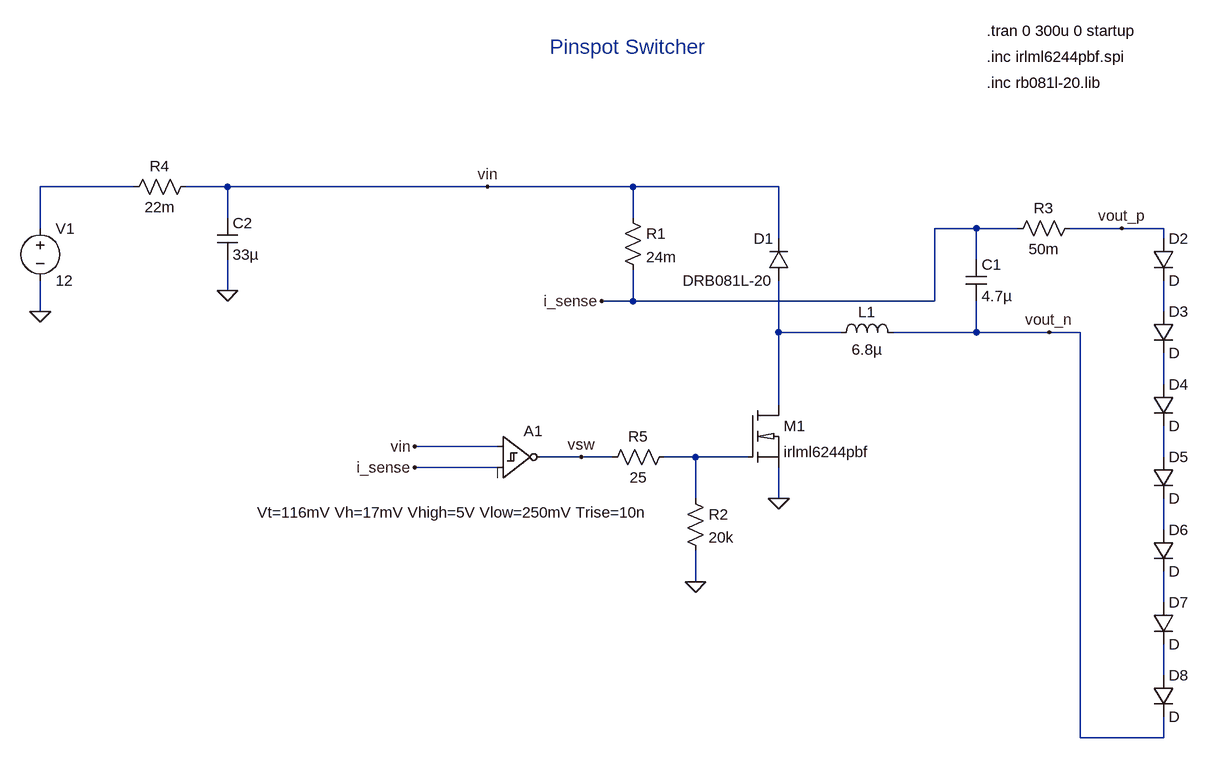
[diagram p0: schematic switcher.asc]
switcher.asc, the LTspice schematic file:
Version 4
SHEET 1 880 1188
WIRE -992 336 -1136 336
WIRE -848 336 -912 336
WIRE -448 336 -848 336
WIRE -224 336 -448 336
WIRE 0 336 -224 336
WIRE -848 384 -848 336
WIRE -224 384 -224 336
WIRE -1136 400 -1136 336
WIRE 304 400 240 400
WIRE 368 400 304 400
WIRE 528 400 448 400
WIRE 592 400 528 400
WIRE 0 416 0 336
WIRE 592 416 592 400
WIRE 304 448 304 400
WIRE -848 496 -848 448
WIRE -224 512 -224 464
WIRE -224 512 -272 512
WIRE 240 512 240 400
WIRE 240 512 -224 512
WIRE -1136 528 -1136 480
WIRE 592 528 592 480
WIRE 0 560 0 480
WIRE 96 560 0 560
WIRE 304 560 304 512
WIRE 304 560 176 560
WIRE 416 560 304 560
WIRE 464 560 416 560
WIRE 592 640 592 592
WIRE 0 672 0 560
WIRE -432 736 -560 736
WIRE -304 752 -368 752
WIRE -256 752 -304 752
WIRE -128 752 -176 752
WIRE -48 752 -128 752
WIRE 592 752 592 704
WIRE -432 768 -560 768
WIRE -128 816 -128 752
WIRE 0 816 0 768
WIRE 592 864 592 816
WIRE -128 944 -128 896
WIRE 592 976 592 928
WIRE 592 1088 592 1040
WIRE 464 1184 464 560
WIRE 592 1184 592 1152
WIRE 592 1184 464 1184
FLAG -128 944 0
FLAG 0 816 0
FLAG -1136 528 0
FLAG -272 512 i_sense
FLAG 528 400 vout_p
FLAG 416 560 vout_n
FLAG -848 496 0
FLAG -448 336 vin
FLAG -560 768 i_sense
FLAG -560 736 vin
FLAG -304 752 vsw
SYMBOL ind 80 576 R270
WINDOW 0 32 56 VTop 2
WINDOW 3 5 56 VBottom 2
SYMATTR InstName L1
SYMATTR Value 6.8µ
SYMATTR SpiceLine Rser=17m
SYMBOL cap 288 448 R0
SYMATTR InstName C1
SYMATTR Value 4.7µ
SYMATTR SpiceLine V=16 Rser=6.8m
SYMBOL res -240 368 R0
SYMATTR InstName R1
SYMATTR Value 24m
SYMBOL irlml6244pbf -48 672 R0
SYMATTR InstName M1
SYMATTR Value irlml6244pbf
SYMATTR Prefix X
SYMBOL res -144 800 R0
SYMATTR InstName R2
SYMATTR Value 20k
SYMBOL diode 576 416 R0
SYMATTR InstName D2
SYMBOL diode 576 528 R0
SYMATTR InstName D3
SYMBOL diode 576 640 R0
SYMATTR InstName D4
SYMBOL diode 576 752 R0
SYMATTR InstName D5
SYMBOL diode 576 864 R0
SYMATTR InstName D6
SYMBOL diode 576 976 R0
SYMATTR InstName D7
SYMBOL diode 576 1088 R0
SYMATTR InstName D8
SYMBOL res 464 384 R90
WINDOW 0 0 56 VBottom 2
WINDOW 3 32 56 VTop 2
SYMATTR InstName R3
SYMATTR Value 50m
SYMBOL res -896 320 R90
WINDOW 0 0 56 VBottom 2
WINDOW 3 32 56 VTop 2
SYMATTR InstName R4
SYMATTR Value 22m
SYMBOL voltage -1136 384 R0
WINDOW 123 0 0 Left 0
WINDOW 39 0 0 Left 0
SYMATTR InstName V1
SYMATTR Value 12
SYMBOL diode 16 480 R180
WINDOW 0 24 64 Left 2
WINDOW 3 24 0 Left 2
SYMATTR InstName D1
SYMATTR Value DRB081L-20
SYMBOL cap -864 384 R0
SYMATTR InstName C2
SYMATTR Value 33µ
SYMATTR SpiceLine Rser=1.5
SYMBOL Digital\\diffschmtinv -432 688 R0
WINDOW 3 -370 149 Left 2
SYMATTR InstName A1
SYMATTR Value Vt=116mV Vh=17mV Vhigh=5V Vlow=250mV Trise=10n
SYMBOL res -160 736 R90
WINDOW 0 0 56 VBottom 2
WINDOW 3 32 56 VTop 2
SYMATTR InstName R5
SYMATTR Value 25
TEXT 320 96 Left 2 !.tran 0 300u 0 startup
TEXT 320 136 Left 2 !.inc irlml6244pbf.spi
TEXT -352 120 Left 3 ;Pinspot Switcher
TEXT 320 176 Left 2 !.inc rb081l-20.lib

The netlist it stands for:
* switcher.asc
L1 N003 vout_n 6.8µ Rser=17m
C1 i_sense vout_n 4.7µ V=16 Rser=6.8m
R1 vin i_sense 24m
XM1 N003 N005 0 irlml6244pbf irlml6244pbf  ; pins D G S
R2 N005 0 20k
D2 vout_p N002 D
D3 N002 N004 D
D4 N004 N006 D
D5 N006 N007 D
D6 N007 N008 D
D7 N008 N009 D
D8 N009 vout_n D
R3 vout_p i_sense 50m
R4 vin N001 22m
V1 N001 0 12
D1 N003 vin DRB081L-20
C2 vin 0 33µ Rser=1.5
A1 vin i_sense 0 0 0 vsw 0 0 SCHMITT Vt=116mV Vh=17mV Vhigh=5V Vlow=250mV Trise=10n
R5 N005 vsw 25
.model D D
.lib standard.dio
.tran 0 300u 0 startup
.inc irlml6244pbf.spi
* Pinspot Switcher
.inc rb081l-20.lib
.backanno
.end